# Altium schematic sheet 10-Sensing.SchDoc: Sensing (part 2 of 2)
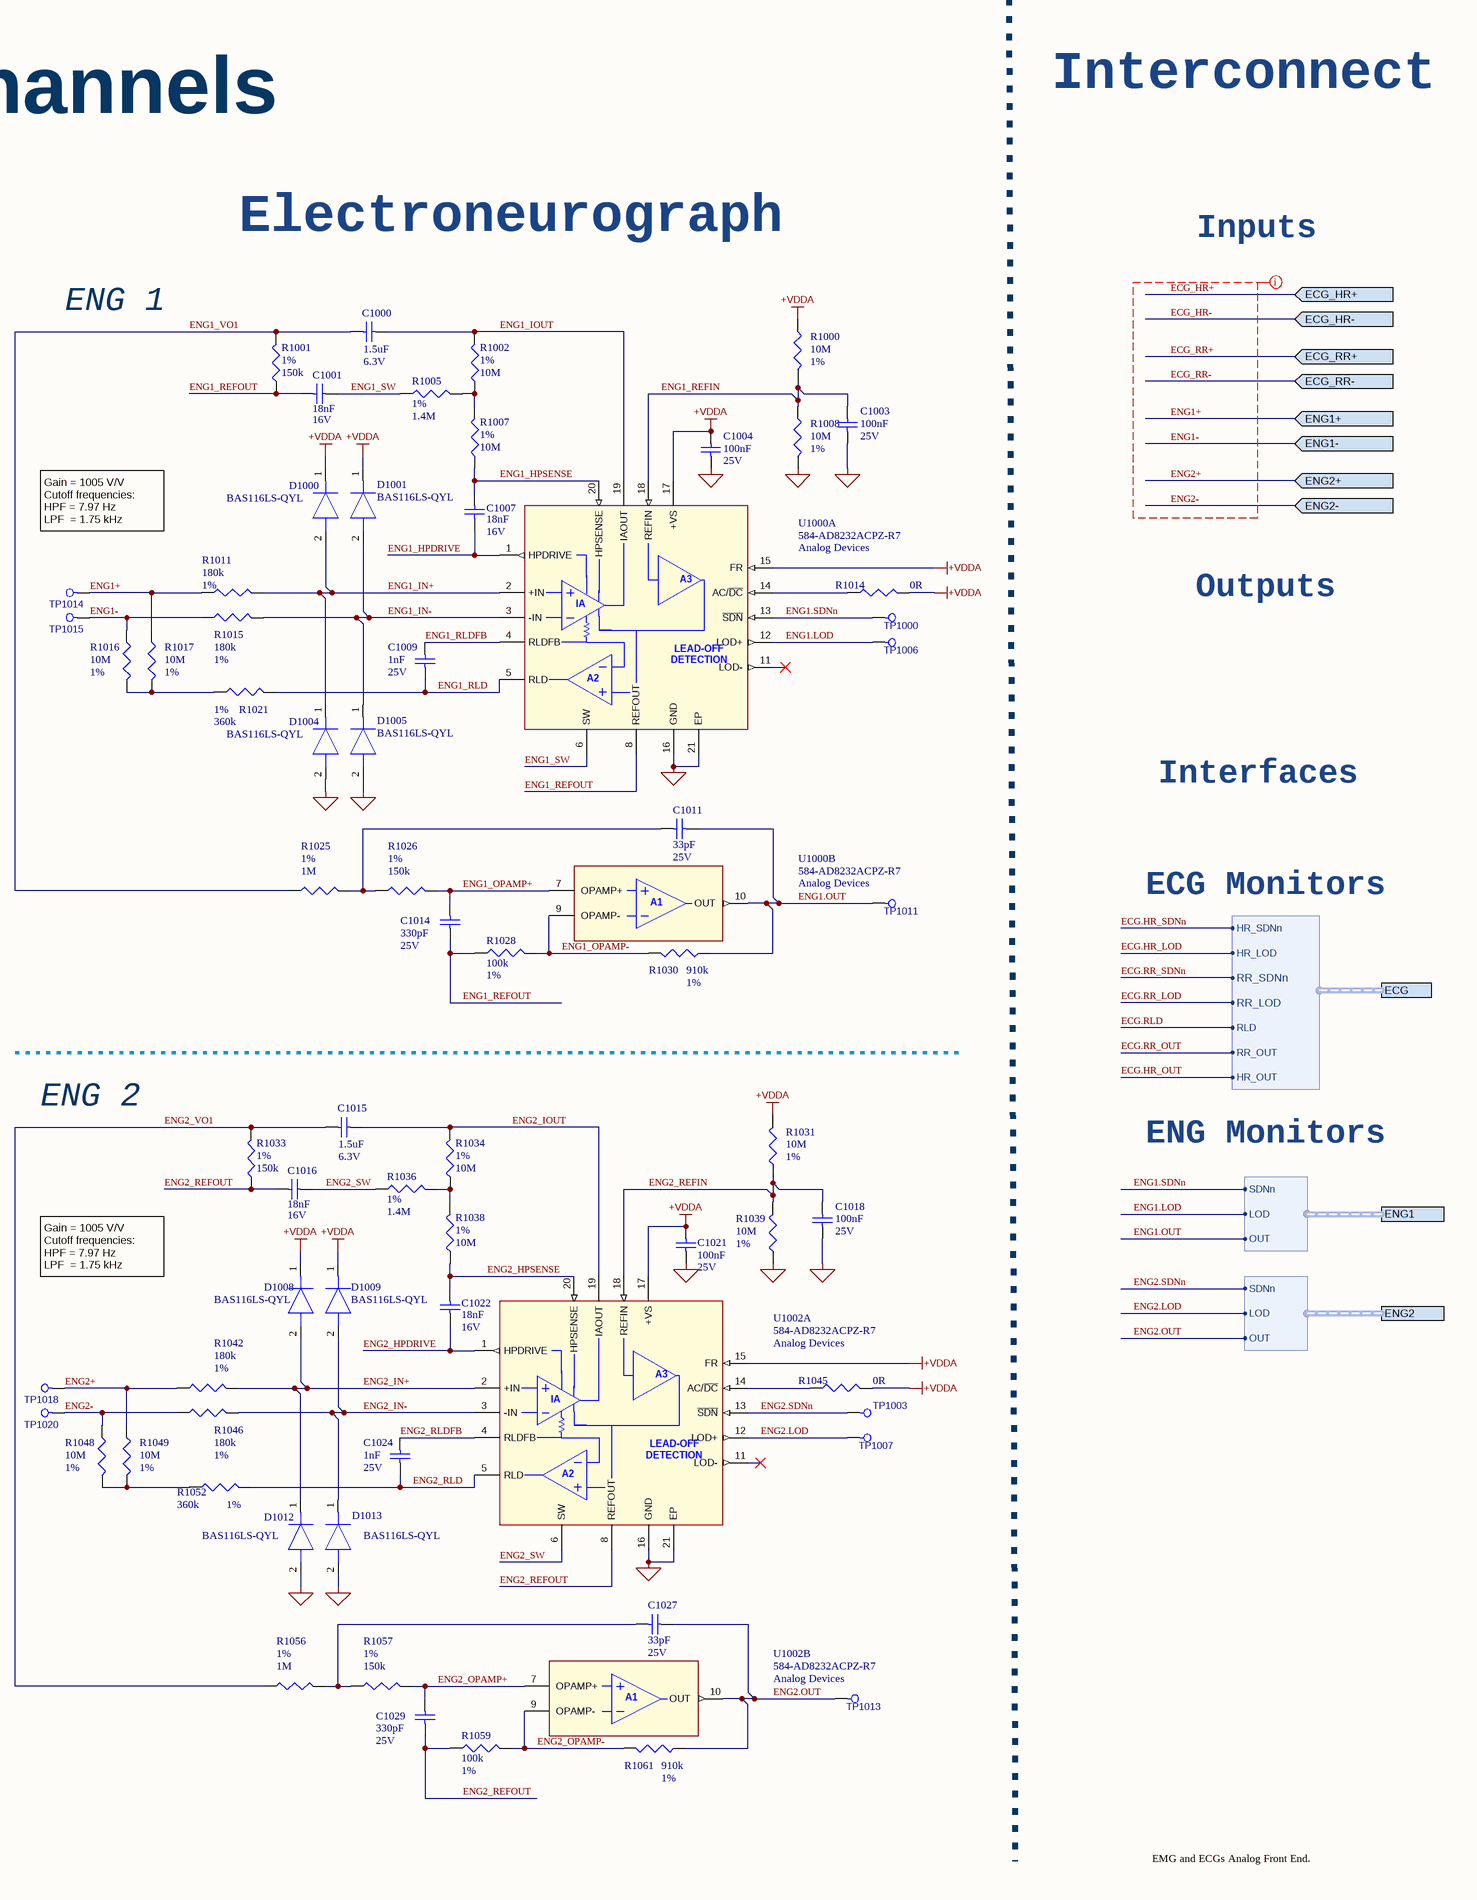
[diagram p2: 10-Sensing.SchDoc, right]

## Library data of the parts
C1000 C1015 = GRM033R60J155ME14D: Ceramic Capacitor, Multilayer, Ceramic, 6.3V, 20% +Tol, 20% -Tol, X5R, 15% TC, 1.5uF, Surface Mount, 0201; Manufacturer: Murata; Multilayer: Yes; Supplier: Digikey; Supplier Part Number: 490-13223-1-ND; Manufacturer Part Number: GRM033R60J155ME14D; RoHS: Yes; Category: Ceramic Capacitors; Stock: 47845; Pricing: 1=0,2, 10=0,131, 50=0,083, 100=0,0664, 500=0,04794, 1000=0,04241, 2500=0,04056, 5000=0,03687 (USD); Mounting Technology: Surface Mount; Pins: 2; Dielectric Material: Ceramic; Package Shape: Rectangular; Case/Package: 0201; Min Operating Temperature: -55°C; Max Operating Temperature: 85°C; Capacitor Type: Ceramic; Tolerance  (fill in as +-): 20%; Packaging: Tape and Reel; Tolerance (fill in as +-): 20%; Temperature Characteristics Code: X5R; Termination: Wraparound; Reach SVHC Compliant: Yes; RoHS Compliant: Yes; ComponentLink1URL: https://psearch.en.murata.com:443/capacitor/product/GRM033R60J155ME14%23.pdf?src-supplier=IHS+Markit; ComponentLink1Description: https://psearch.en.murata.com:443/capacitor/product/GRM033R60J155ME14%23.pdf?src-supplier=IHS+Markit; ComponentLink2URL: http://search.murata.co.jp/Ceramy/image/img/A01X/G101/ENG/GRM033R60J155ME14-01.pdf?src-supplier=Digikey; ComponentLink2Description: http://search.murata.co.jp/Ceramy/image/img/A01X/G101/ENG/GRM033R60J155ME14-01.pdf?src-supplier=Digikey; ComponentLink3URL: http://search.murata.co.jp/Ceramy/image/img/A01X/partnumbering_e_01.pdf?src-supplier=Digikey; ComponentLink3Description: http://search.murata.co.jp/Ceramy/image/img/A01X/partnumbering_e_01.pdf?src-supplier=Digikey; Supplier 1: Arrow Electronics; Supplier Part Number 1: GRM033R60J155ME14D
C1001 C1007 C1016 C1022 = GRM033R61C183KE84D: Ceramic Capacitor, Multilayer, Ceramic, 16V, 20% +Tol, 20% -Tol, X5R, 15% TC, 0.018uF, Surface Mount, 0201; Manufacturer: Murata; Multilayer: Yes; Manufacturer Part Number: GRM033R61C183KE84D; Category: Ceramic Capacitors; Supplier 1: Digikey; Supplier Part Number 1: 490-10414-1-ND; RoHS: Yes; Stock: 109140; Pricing: 1=0,1, 10=0,044, 50=0,0254, 100=0,0196, 500=0,01478, 1000=0,01161, 2500=0,01056, 5000=0,00971 (USD); Mounting Technology: Surface Mount; Pins: 2; Dielectric Material: Ceramic; Package Shape: Rectangular; Case/Package: 0201; Terminal Finish: Nickel; Min Operating Temperature: -55°C; Max Operating Temperature: 85°C; JESD-609 Code: e3; Capacitor Type: Ceramic; Tolerance  (fill in as +-): 20%; Package Style: SMTMeter; Packaging: Tape and Reel; Tolerance (fill in as +-): 20%; Temperature Characteristics Code: X5R; Termination: Wraparound; Length: 0.6mm; Width: 0.3mm; Height: 0.3mm; Reach SVHC Compliant: Yes; RoHS Compliant: Yes; ComponentLink1URL: https://psearch.en.murata.com:443/capacitor/product/GRM033R61C223ME84%23.pdf?src-supplier=IHS+Markit; ComponentLink1Description: https://psearch.en.murata.com:443/capacitor/product/GRM033R61C223ME84%23.pdf?src-supplier=IHS+Markit; ComponentLink2URL: http://www.farnell.com/datasheets/2735417.pdf?src-supplier=Farnell; ComponentLink2Description: http://www.farnell.com/datasheets/2735417.pdf?src-supplier=Farnell; ComponentLink3URL: http://search.murata.co.jp/Ceramy/image/img/A01X/G101/ENG/GRM033R61C223ME84-01.pdf?src-supplier=Digikey; ComponentLink3Description: http://search.murata.co.jp/Ceramy/image/img/A01X/G101/ENG/GRM033R61C223ME84-01.pdf?src-supplier=Digikey
C1002 C1008 = CGA2B1X7S1C334K050BC: Capacitor, 0.33uF, X7S, 16V, 10%, 0402; Manufacturer: TDK; Medical Grade MFR: TBD; Review: 020823; Length (mm): 1.00 ±0.05; Medical Grade MFR PN: TBD; PCB Footprint: cap0402_reduced; Thickness (mm): 0.50 ±0.05; Width (mm): 0.50 ±0.05; Category: Capacitor; Package Description: 0402; Supplier 1: Arrow Electronics; Supplier Part Number 1: CGA2B1X7S1C334K050BC; Status: Approved; Manufacturer Part Number: CGA2B1X7S1C334K050BC
C1003-C1006 C1018-C1021 C1026 C1028 = GRM033R61E104KE14J: Ceramic Capacitor, Multilayer, Ceramic, 25V, 10% +Tol, 10% -Tol, X5R, 15% TC, 0.1uF, Surface Mount, 0201; Manufacturer: Murata; Multilayer: Yes; Category: Ceramic Capacitors; Supplier: Digikey; Supplier Part Number: 490-14571-1-ND; Manufacturer Part Number: GRM033R61E104KE14J; RoHS: Yes; Stock: 1540851; Pricing: 1=0,1, 10=0,033, 50=0,0192, 100=0,0148, 500=0,01118, 1000=0,00878, 2500=0,00798, 5000=0,00734 (USD); Mounting Technology: Surface Mount; Pins: 2; Dielectric Material: Ceramic; Package Shape: Rectangular; Case/Package: 0201; Terminal Finish: Nickel; Min Operating Temperature: -55°C; Max Operating Temperature: 85°C; JESD-609 Code: e3; Capacitor Type: Ceramic; Tolerance  (fill in as +-): 10%; Package Style: SMTMeter; Packaging: Tape and Reel; Tolerance (fill in as +-): 10%; Temperature Characteristics Code: X5R; Termination: Wraparound; Length: 0.6mm; Width: 0.3mm; Height: 0.3mm; Reach SVHC Compliant: Yes; RoHS Compliant: Yes; ComponentLink1URL: https://psearch.en.murata.com:443/capacitor/product/GRM033R61E104KE14%23.pdf?src-supplier=IHS+Markit; ComponentLink1Description: https://psearch.en.murata.com:443/capacitor/product/GRM033R61E104KE14%23.pdf?src-supplier=IHS+Markit; ComponentLink2URL: http://www.mouser.com/ds/2/281/c02e-2905.pdf?src-supplier=Mouser; ComponentLink2Description: http://www.mouser.com/ds/2/281/c02e-2905.pdf?src-supplier=Mouser; ComponentLink3URL: http://search.murata.co.jp/Ceramy/image/img/A01X/G101/ENG/GRM033R61E104KE14-01.pdf?src-supplier=Digikey; ComponentLink3Description: http://search.murata.co.jp/Ceramy/image/img/A01X/G101/ENG/GRM033R61E104KE14-01.pdf?src-supplier=Digikey; ComponentLink4URL: https://search.murata.co.jp/Ceramy/image/img/A01X/G101/ENG/GRM033R61E104KE14-01.pdf?src-supplier=Digikey; ComponentLink4Description: https://search.murata.co.jp/Ceramy/image/img/A01X/G101/ENG/GRM033R61E104KE14-01.pdf?src-supplier=Digikey; Supplier 1: Arrow Electronics; Supplier Part Number 1: GRM033R61E104KE14J
C1009 C1010 C1013 C1024 C1025 = GRM033R71E102KA01J: Ceramic Capacitor, Multilayer, Ceramic, 25V, 10% +Tol, 10% -Tol, X7R, 15% TC, 0.001uF, Surface Mount, 0201; Manufacturer: Murata; Multilayer: Yes; Supplier: Digikey; Supplier Part Number: 490-8161-1-ND; Manufacturer Part Number: GRM033R71E102KA01J; RoHS: Yes; Category: Ceramic Capacitors; Stock: 136185; Pricing: 1=0,1, 10=0,01, 50=0,0056, 100=0,0044, 500=0,00328, 1000=0,00258, 2500=0,00234, 5000=0,00216 (USD); Mounting Technology: Surface Mount; Pins: 2; Dielectric Material: Ceramic; Package Shape: Rectangular; Case/Package: 0201; Terminal Finish: Nickel; Min Operating Temperature: -55°C; Max Operating Temperature: 125°C; JESD-609 Code: e3; Capacitor Type: Ceramic; Tolerance  (fill in as +-): 10%; Package Style: SMTMeter; Packaging: Tape and Reel; Tolerance (fill in as +-): 10%; Temperature Characteristics Code: X7R; Termination: Wraparound; Length: 0.6mm; Width: 0.3mm; Height: 0.3mm; Reach SVHC Compliant: Yes; RoHS Compliant: Yes; ComponentLink1URL: https://psearch.en.murata.com:443/capacitor/product/GRM033R71E102KA01%23.pdf?src-supplier=IHS+Markit; ComponentLink1Description: https://psearch.en.murata.com:443/capacitor/product/GRM033R71E102KA01%23.pdf?src-supplier=IHS+Markit; ComponentLink2URL: https://datasheet.ciiva.com/5453/product-5453157.pdf?src-supplier=Mouser; ComponentLink2Description: https://datasheet.ciiva.com/5453/product-5453157.pdf?src-supplier=Mouser; ComponentLink3URL: https://datasheet.ciiva.com/11621/product-11621675.pdf?src-supplier=Avnet; ComponentLink3Description: https://datasheet.ciiva.com/11621/product-11621675.pdf?src-supplier=Avnet; Supplier 1: Arrow Electronics; Supplier Part Number 1: GRM033R71E102KA01J
C1011 C1027 = GRM0335C1E330JA01D: Ceramic Capacitor, Multilayer, Ceramic, 25V, 5% +Tol, 5% -Tol, C0G, 30ppm/Cel TC, 0.000033uF, Surface Mount, 0201; Manufacturer: Murata; Multilayer: Yes; Supplier: Digikey; Supplier Part Number: 490-10678-1-ND; Manufacturer Part Number: GRM0335C1E330JA01D; RoHS: Yes; Category: Ceramic Capacitors; Stock: 355128; Pricing: 1=0,1, 10=0,011, 50=0,0062, 100=0,0048, 500=0,0036, 1000=0,00283, 2500=0,00258, 5000=0,00237 (USD); Mounting Technology: Surface Mount; Pins: 2; Dielectric Material: Ceramic; Package Shape: Rectangular; Case/Package: 0201; Terminal Finish: Nickel; Min Operating Temperature: -55°C; Max Operating Temperature: 125°C; JESD-609 Code: e3; Capacitor Type: Ceramic; Package Style: SMTMeter; Packaging: Tape and Reel; Temperature Characteristics Code: C0G; Termination: Wraparound; Length: 0.6mm; Width: 0.3mm; Height: 0.3mm; Reach SVHC Compliant: Yes; RoHS Compliant: Yes; Supplier 1: Arrow Electronics; Supplier Part Number 1: GRM0335C1E330JA01D; Tolerance  (fill in as +-): 5%; Tolerance (fill in as +-): 5%; ComponentLink1URL: https://datasheet.ciiva.com:443/pdfs/VipMasterIC/IC/MURE/MURE-S-A0004347008/MURE-S-A0004347461-1.pdf?src-supplier=IHS+Markit; ComponentLink1Description: https://datasheet.ciiva.com:443/pdfs/VipMasterIC/IC/MURE/MURE-S-A0004347008/MURE-S-A0004347461-1.pdf?src-supplier=IHS+Markit; ComponentLink2URL: https://datasheet.ciiva.com/29538/partnumbering-e-01-29538933.pdf?src-supplier=Digikey; ComponentLink2Description: https://datasheet.ciiva.com/29538/partnumbering-e-01-29538933.pdf?src-supplier=Digikey
C1012 = GCM155R71H152KA37D: Capacitor, 1500pF, X7R, 50V, 10%, 0402; Manufacturer: Murata; Medical Grade MFR: TBD; Review: 020823; Length (mm): 1.00 ±0.05; Medical Grade MFR PN: TBD; PCB Footprint: cap0402_reduced; Thickness (mm): 0.50 ±0.05; Width (mm): 0.50 ±0.05; Category: Capacitor; Package Description: 0402; Supplier 1: Arrow Electronics; Supplier Part Number 1: GCM155R71H152KA37D; Status: Approved; Manufacturer Part Number: GCM155R71H152KA37D
C1014 C1029 = GRM033R71E331KA01D: Ceramic Capacitor, Multilayer, Ceramic, 25V, 10% +Tol, 10% -Tol, X7R, 15% TC, 0.00033uF, Surface Mount, 0201; Manufacturer: Murata; Multilayer: Yes; Supplier: Digikey; Supplier Part Number: 490-3178-1-ND; Manufacturer Part Number: GRM033R71E331KA01D; RoHS: Yes; Category: Ceramic Capacitors; Stock: 408699; Pricing: 1=0,1, 10=0,02, 50=0,0118, 100=0,0091, 500=0,00684, 1000=0,00538, 2500=0,00489, 5000=0,0045 (USD); Mounting Technology: Surface Mount; Pins: 2; Dielectric Material: Ceramic; Package Shape: Rectangular; Case/Package: 0201; Terminal Finish: Nickel; Min Operating Temperature: -55°C; Max Operating Temperature: 125°C; JESD-609 Code: e3; Capacitor Type: Ceramic; Tolerance  (fill in as +-): 10%; Package Style: SMTMeter; Packaging: Tape and Reel; Tolerance (fill in as +-): 10%; Temperature Characteristics Code: X7R; Termination: Wraparound; Length: 0.6mm; Width: 0.3mm; Height: 0.3mm; Reach SVHC Compliant: Yes; RoHS Compliant: Yes; Supplier 1: Arrow Electronics; Supplier Part Number 1: GRM033R71E331KA01D; ComponentLink1URL: https://psearch.en.murata.com:443/capacitor/product/GRM033R71E331KA01%23.pdf?src-supplier=IHS+Markit; ComponentLink1Description: https://psearch.en.murata.com:443/capacitor/product/GRM033R71E331KA01%23.pdf?src-supplier=IHS+Markit; ComponentLink2URL: https://datasheet.ciiva.com/16396/product-16396160.pdf?src-supplier=Future+Electronics; ComponentLink2Description: https://datasheet.ciiva.com/16396/product-16396160.pdf?src-supplier=Future+Electronics; ComponentLink3URL: https://datasheet.ciiva.com/18184/getdatasheetpartid-228493-18184123.pdf?src-supplier=Verical; ComponentLink3Description: https://datasheet.ciiva.com/18184/getdatasheetpartid-228493-18184123.pdf?src-supplier=Verical; ComponentLink4URL: https://datasheet.ciiva.com/29199/455855-da-01-en-vs-kondensator-0201-29199192.pdf?src-supplier=Conrad; ComponentLink4Description: https://datasheet.ciiva.com/29199/455855-da-01-en-vs-kondensator-0201-29199192.pdf?src-supplier=Conrad; ComponentLink5URL: https://datasheet.ciiva.com/6068/482872-6068150.pdf?src-supplier=Farnell; ComponentLink5Description: https://datasheet.ciiva.com/6068/482872-6068150.pdf?src-supplier=Farnell; ComponentLink6URL: https://datasheet.ciiva.com/7937/482872-7937607.pdf?src-supplier=Element14; ComponentLink6Description: https://datasheet.ciiva.com/7937/482872-7937607.pdf?src-supplier=Element14; ComponentLink7URL: https://datasheet.ciiva.com/7937/482872-7937608.pdf?src-supplier=Element14; ComponentLink7Description: https://datasheet.ciiva.com/7937/482872-7937608.pdf?src-supplier=Element14; ComponentLink8URL: https://datasheet.ciiva.com/161/grm033r71e331ka01-01-161478.pdf?src-supplier=Digikey; ComponentLink8Description: https://datasheet.ciiva.com/161/grm033r71e331ka01-01-161478.pdf?src-supplier=Digikey; ComponentLink9URL: https://datasheet.ciiva.com/161/grm033r71e331ka01-01-161479.pdf?src-supplier=Digikey; ComponentLink9Description: https://datasheet.ciiva.com/161/grm033r71e331ka01-01-161479.pdf?src-supplier=Digikey; ComponentLink10URL: https://datasheet.ciiva.com/11604/product-11604876.pdf?src-supplier=Avnet; ComponentLink10Description: https://datasheet.ciiva.com/11604/product-11604876.pdf?src-supplier=Avnet
C1017 C1023 = GRM188Z71C225ME43J: Capacitor, 2.2uF, X7R, 16V, 10%, 0603, Implant-grade; Manufacturer: Murata; Medical Grade MFR: TBD; Review: 020823; Length (mm): 1.60 ±0.10; Medical Grade MFR PN: TBD; PCB Footprint: cap0603_reduced; Thickness (mm): 0.80 ±0.10; Width (mm): 0.80 ±0.10; Category: Capacitor; Package Description: 0603; Supplier 1: Digi-Key; Supplier Part Number 1: 490-GRM188Z71C225ME43JCT-ND; Status: Approved; Manufacturer Part Number: GRM188Z71C225ME43J
D1000-D1015 = BAS116LS-QYL: Diode; Manufacturer: Nexperia; Datasheet Link: https://assets.nexperia.com/documents/data-sheet/BAS116LS-Q.pdf; Height: 0.5mm; Mouser Part Number: 771-BAS116LS-QYL; Mouser Price/Stock: https://www.mouser.co.uk/ProductDetail/Nexperia/BAS116LS-QYL?qs=Li%252BoUPsLEnuSHegtSMB1TQ%3D%3D; Arrow Part Number: BAS116LS-QYL; Arrow Price/Stock: https://www.arrow.com/en/products/bas116ls-qyl/nexperia?region=nac; Supplier 1: Digikey; Supplier Part Number 1: 1727-BAS116LS-QYLCT-ND; Manufacturer Part Number: BAS116LS-QYL
R1000 R1002-R1004 R1007-R1010 R1016 R1017 R1019 R1020 R1031 R1032 R1034 R1038 R1039 R1041 R1048-R1051 = CRCW020110M0FNED: Fixed Resistor, Metal Glaze/thick Film, 0.05W, 10000000ohm, 30V, 1% +/-Tol, 200ppm/Cel, Surface Mount, 0201; Manufacturer: Vishay Draloric; Medical Grade MFR: Mini-Systems; Medical Grade MFR PN: MWA96SM-1005F-NS62TR; Power: 50mW; Rated Temperature: 70°C; Temperature Coefficient: 200ppm/°C; Category: Chip SMD Resistors; Supplier: Mouser; Supplier Part Number: 71-CRCW020110M0FNED; Manufacturer Part Number: CRCW020110M0FNED; RoHS: Yes; Stock: 159754; Pricing: 1=0,1, 10=0,024, 50=0,024, 100=0,014, 1000=0,011, 10000=0,006 (USD); Mounting Technology: Surface Mount; Pins: 2; Package Shape: Rectangular; Case/Package: 0201; Terminal Finish: Nickel; Min Operating Temperature: -55°C; Max Operating Temperature: 155°C; JESD-609 Code: e3; Resistor Type: FIXED RESISTOR; Packaging: Tape and Reel; Technology: METAL GLAZE/THICK FILM; Termination: Wraparound; Working Voltage: 30V; Reach SVHC Compliant: Yes; RoHS Compliant: Yes; ComponentLink1URL: https://datasheet.ciiva.com:443/pdfs/VipMasterIC/IC/VISH/VISH-S-A0002932828/VISH-S-A0002932828-1.pdf?src-supplier=IHS+Markit; ComponentLink1Description: https://datasheet.ciiva.com:443/pdfs/VipMasterIC/IC/VISH/VISH-S-A0002932828/VISH-S-A0002932828-1.pdf?src-supplier=IHS+Markit; ComponentLink2URL: https://datasheet.ciiva.com/7673/1719906-7673177.pdf?src-supplier=Element14; ComponentLink2Description: https://datasheet.ciiva.com/7673/1719906-7673177.pdf?src-supplier=Element14; ComponentLink3URL: https://datasheet.ciiva.com/7673/1719906-7673178.pdf?src-supplier=Element14; ComponentLink3Description: https://datasheet.ciiva.com/7673/1719906-7673178.pdf?src-supplier=Element14; ComponentLink4URL: https://datasheet.ciiva.com/22692/1719906-22692711.pdf?src-supplier=Element14; ComponentLink4Description: https://datasheet.ciiva.com/22692/1719906-22692711.pdf?src-supplier=Element14; ComponentLink5URL: https://datasheet.ciiva.com/22665/1700795-22665701.pdf?src-supplier=Element14; ComponentLink5Description: https://datasheet.ciiva.com/22665/1700795-22665701.pdf?src-supplier=Element14; Supplier 1: Digikey; Supplier Part Number 1: 541-CRCW020110M0FNEDCT-ND
R1001 R1026 R1033 R1057 = CRCW0201150KFNED: Fixed Resistor, Metal Glaze/thick Film, 0.05W, 150000ohm, 30V, 1% +/-Tol, 200ppm/Cel, Surface Mount, 0201; Manufacturer: Vishay; Medical Grade MFR: Mini-Systems; Medical Grade MFR PN: MWA96SM-1503F-NS62TR; Power: 50mW; Rated Temperature: 70°C; Temperature Coefficient: 200ppm/°C; Package Height: 0.23mm; Package Length: 0.6mm; Package Width: 0.3mm; Reference Standard: AEC-Q200; Supplier: Digikey; Supplier Part Number: 541-CRCW0201150KFNEDCT-ND; Manufacturer Part Number: CRCW0201150KFNED; RoHS: Yes; Category: Chip SMD Resistors; Stock: 35009; Pricing: 1=0,1, 10=0,037, 50=0,0242, 100=0,0204, 500=0,01426, 1000=0,01241, 5000=0,00924 (USD); Mounting Technology: Surface Mount; Pins: 2; Package Shape: Rectangular; Case/Package: 0201; Terminal Finish: Nickel; Min Operating Temperature: -55°C; Max Operating Temperature: 155°C; JESD-609 Code: e3; Resistor Type: FIXED RESISTOR; Construction: Chip; Package Style: SMTMeter; Packaging: Tape and Reel; Technology: METAL GLAZE/THICK FILM; Termination: Wraparound; Working Voltage: 30V; Reach SVHC Compliant: Yes; RoHS Compliant: Yes; ComponentLink1URL: https://datasheet.ciiva.com:443/pdfs/VipMasterIC/IC/VISH/VISH-S-A0002932828/VISH-S-A0002932828-1.pdf?src-supplier=IHS+Markit; ComponentLink1Description: https://datasheet.ciiva.com:443/pdfs/VipMasterIC/IC/VISH/VISH-S-A0002932828/VISH-S-A0002932828-1.pdf?src-supplier=IHS+Markit; ComponentLink2URL: https://datasheet.ciiva.com/7673/1719906-7673181.pdf?src-supplier=Element14; ComponentLink2Description: https://datasheet.ciiva.com/7673/1719906-7673181.pdf?src-supplier=Element14; ComponentLink3URL: https://datasheet.ciiva.com/7673/1719906-7673182.pdf?src-supplier=Element14; ComponentLink3Description: https://datasheet.ciiva.com/7673/1719906-7673182.pdf?src-supplier=Element14; ComponentLink4URL: https://datasheet.ciiva.com/2577/crcw0201e3-2577323.pdf?src-supplier=Digikey; ComponentLink4Description: https://datasheet.ciiva.com/2577/crcw0201e3-2577323.pdf?src-supplier=Digikey; ComponentLink5URL: https://datasheet.ciiva.com/8968/crcw0201e3-8968685.pdf?src-supplier=Avnet; ComponentLink5Description: https://datasheet.ciiva.com/8968/crcw0201e3-8968685.pdf?src-supplier=Avnet; ComponentLink6URL: https://datasheet.ciiva.com/22692/1719906-22692733.pdf?src-supplier=Element14; ComponentLink6Description: https://datasheet.ciiva.com/22692/1719906-22692733.pdf?src-supplier=Element14; Supplier 1: Digikey; Supplier Part Number 1: 541-CRCW0201150KFNEDDKR-ND
R1005 R1006 R1036 = CRCW02011M40FNED: Fixed Resistor, Metal Glaze/thick Film, 0.05W, 1400000ohm, 30V, 1% +/-Tol, 200ppm/Cel, Surface Mount, 0201; Manufacturer: Vishay Draloric; Medical Grade MFR: Mini-Systems; Medical Grade MFR PN: MWA96SM-1404F-NS62TR; Power: 50mW; Rated Temperature: 70°C; Temperature Coefficient: 200ppm/°C; Supplier: Digikey; Supplier Part Number: 541-CRCW02011M40FNEDCT-ND; Manufacturer Part Number: CRCW02011M40FNED; RoHS: Yes; Category: Chip SMD Resistors; Stock: 24065; Pricing: 1=0,1, 10=0,037, 50=0,0242, 100=0,0204, 500=0,01426, 1000=0,01241, 5000=0,00924 (USD); Mounting Technology: Surface Mount; Pins: 2; Package Shape: Rectangular; Case/Package: 0201; Terminal Finish: Nickel; Min Operating Temperature: -55°C; Max Operating Temperature: 155°C; JESD-609 Code: e3; Resistor Type: FIXED RESISTOR; Packaging: Tape and Reel; Termination: Wraparound; Working Voltage: 30V; Reach SVHC Compliant: Yes; RoHS Compliant: Yes; Supplier 1: Digikey; Supplier Part Number 1: 541-CRCW02011M40FNEDCT-ND; Technology: METAL GLAZE/THICK FILM; ComponentLink1URL: https://datasheet.ciiva.com:443/pdfs/VipMasterIC/IC/VISH/VISH-S-A0002932828/VISH-S-A0002932828-1.pdf?src-supplier=IHS+Markit; ComponentLink1Description: https://datasheet.ciiva.com:443/pdfs/VipMasterIC/IC/VISH/VISH-S-A0002932828/VISH-S-A0002932828-1.pdf?src-supplier=IHS+Markit; ComponentLink2URL: http://www.farnell.com/datasheets/2111203.pdf?src-supplier=Farnell; ComponentLink2Description: http://www.farnell.com/datasheets/2111203.pdf?src-supplier=Farnell; ComponentLink3URL: http://www.farnell.com/datasheets/2238160.pdf?src-supplier=Farnell; ComponentLink3Description: http://www.farnell.com/datasheets/2238160.pdf?src-supplier=Farnell; ComponentLink4URL: http://www.farnell.com/datasheets/2111203.pdf?src-supplier=Element14; ComponentLink4Description: http://www.farnell.com/datasheets/2111203.pdf?src-supplier=Element14; ComponentLink5URL: http://www.farnell.com/datasheets/2045973.pdf?src-supplier=Element14; ComponentLink5Description: http://www.farnell.com/datasheets/2045973.pdf?src-supplier=Element14; ComponentLink6URL: http://www.farnell.com/datasheets/1719906.pdf?src-supplier=Element14; ComponentLink6Description: http://www.farnell.com/datasheets/1719906.pdf?src-supplier=Element14; ComponentLink7URL: http://www.vishay.com/docs/20052/crcw0201e3.pdf?src-supplier=Digikey; ComponentLink7Description: http://www.vishay.com/docs/20052/crcw0201e3.pdf?src-supplier=Digikey
R1011 R1012 R1015 R1018 R1042 R1043 R1046 R1047 = CRCW0201180KFNED: Fixed Resistor, Metal Glaze/thick Film, 0.05W, 180000ohm, 30V, 1% +/-Tol, 200ppm/Cel, Surface Mount, 0201; Manufacturer: Vishay; Medical Grade MFR: Mini-Systems; Medical Grade MFR PN: MWA96SM-1803F-NS62TR; Power: 50mW; Rated Temperature: 70°C; Temperature Coefficient: 200ppm/°C; Package Height: 0.23mm; Package Length: 0.6mm; Package Width: 0.3mm; Reference Standard: AEC-Q200; Category: Chip SMD Resistors; Supplier: Digikey; Supplier Part Number: 541-CRCW0201180KFNEDCT-ND; Manufacturer Part Number: CRCW0201180KFNED; RoHS: Yes; Stock: 52185; Pricing: 1=0,1, 10=0,037, 50=0,0242, 100=0,0204, 500=0,01426, 1000=0,01241, 5000=0,00924 (USD); Mounting Technology: Surface Mount; Pins: 2; Package Shape: Rectangular; Case/Package: 0201; Terminal Finish: Nickel; Min Operating Temperature: -55°C; Max Operating Temperature: 155°C; JESD-609 Code: e3; Resistor Type: FIXED RESISTOR; Construction: Chip; Package Style: SMTMeter; Packaging: Tape and Reel; Technology: METAL GLAZE/THICK FILM; Termination: Wraparound; Working Voltage: 30V; Reach SVHC Compliant: Yes; RoHS Compliant: Yes; ComponentLink1URL: https://datasheet.ciiva.com:443/pdfs/VipMasterIC/IC/VISH/VISH-S-A0002932828/VISH-S-A0002932828-1.pdf?src-supplier=IHS+Markit; ComponentLink1Description: https://datasheet.ciiva.com:443/pdfs/VipMasterIC/IC/VISH/VISH-S-A0002932828/VISH-S-A0002932828-1.pdf?src-supplier=IHS+Markit; ComponentLink2URL: https://datasheet.ciiva.com/7714/1719906-7714127.pdf?src-supplier=Element14; ComponentLink2Description: https://datasheet.ciiva.com/7714/1719906-7714127.pdf?src-supplier=Element14; ComponentLink3URL: https://datasheet.ciiva.com/22665/1700795-22665798.pdf?src-supplier=Element14; ComponentLink3Description: https://datasheet.ciiva.com/22665/1700795-22665798.pdf?src-supplier=Element14; ComponentLink4URL: https://datasheet.ciiva.com/22692/1719906-22692745.pdf?src-supplier=Element14; ComponentLink4Description: https://datasheet.ciiva.com/22692/1719906-22692745.pdf?src-supplier=Element14; Supplier 1: Digikey; Supplier Part Number 1: 541-CRCW0201180KFNEDCT-ND
R1013 R1014 R1044 R1045 = CRCW02010000Z0ED: Fixed Resistor, Metal Glaze/thick Film, 0.05W, 0ohm, Surface Mount, 0201; Manufacturer: Vishay; Medical Grade MFR: Mini-Systems; Medical Grade MFR PN: MWA96SM-0000F-NS62TR; Power: 50mW; Rated Temperature: 70°C; Package Height: 0.23mm; Package Length: 0.6mm; Package Width: 0.3mm; Reference Standard: AEC-Q200; Category: Chip SMD Resistors; Supplier: Digikey; Supplier Part Number: 541-0.0AGCT-ND; Manufacturer Part Number: CRCW02010000Z0ED; RoHS: Yes; Stock: 701366; Pricing: 1=0,1, 10=0,034, 25=0,026, 50=0,0198, 100=0,0138, 250=0,01112, 500=0,0089, 1000=0,00655, 5000=0,0047 (USD); Mounting Technology: Surface Mount; Pins: 2; Package Shape: Rectangular; Case/Package: 0201; Terminal Finish: Nickel; Min Operating Temperature: -55°C; Max Operating Temperature: 155°C; JESD-609 Code: e3; Resistor Type: FIXED RESISTOR; Construction: Chip; Package Style: SMTMeter; Packaging: Tape and Reel; Technology: METAL GLAZE/THICK FILM; Termination: Wraparound; Reach SVHC Compliant: Yes; RoHS Compliant: Yes; ComponentLink1URL: https://datasheet.ciiva.com:443/pdfs/VipMasterIC/IC/VISH/VISH-S-A0002932828/VISH-S-A0002932828-1.pdf?src-supplier=IHS+Markit; ComponentLink1Description: https://datasheet.ciiva.com:443/pdfs/VipMasterIC/IC/VISH/VISH-S-A0002932828/VISH-S-A0002932828-1.pdf?src-supplier=IHS+Markit; ComponentLink2URL: https://datasheet.ciiva.com/2471/crcw0201e3-2471712.pdf?src-supplier=Digikey; ComponentLink2Description: https://datasheet.ciiva.com/2471/crcw0201e3-2471712.pdf?src-supplier=Digikey; ComponentLink3URL: https://datasheet.ciiva.com/7841/1719906-7841431.pdf?src-supplier=Element14; ComponentLink3Description: https://datasheet.ciiva.com/7841/1719906-7841431.pdf?src-supplier=Element14; ComponentLink4URL: https://datasheet.ciiva.com/7841/1719906-7841430.pdf?src-supplier=Element14; ComponentLink4Description: https://datasheet.ciiva.com/7841/1719906-7841430.pdf?src-supplier=Element14; ComponentLink5URL: https://datasheet.ciiva.com/22665/1847332-22665688.pdf?src-supplier=Element14; ComponentLink5Description: https://datasheet.ciiva.com/22665/1847332-22665688.pdf?src-supplier=Element14; ComponentLink6URL: https://datasheet.ciiva.com/2471/crcw0201e3-2471713.pdf?src-supplier=Digikey; ComponentLink6Description: https://datasheet.ciiva.com/2471/crcw0201e3-2471713.pdf?src-supplier=Digikey; ComponentLink7URL: https://datasheet.ciiva.com/2471/crcw0201e3-2471711.pdf?src-supplier=Digikey; ComponentLink7Description: https://datasheet.ciiva.com/2471/crcw0201e3-2471711.pdf?src-supplier=Digikey; ComponentLink8URL: https://datasheet.ciiva.com/16757/70202042-16757849.pdf?src-supplier=Allied+Electronics; ComponentLink8Description: https://datasheet.ciiva.com/16757/70202042-16757849.pdf?src-supplier=Allied+Electronics; ComponentLink9URL: https://datasheet.ciiva.com/16436/crcw0201e3-16436237.pdf?src-supplier=Future+Electronics; ComponentLink9Description: https://datasheet.ciiva.com/16436/crcw0201e3-16436237.pdf?src-supplier=Future+Electronics; Supplier 1: Digikey; Supplier Part Number 1: 541-0.0AGDKR-ND
R1021 R1022 R1052 R1053 = CRCW0201360KFNED: Fixed Resistor, Metal Glaze/thick Film, 0.05W, 360000ohm, 30V, 1% +/-Tol, 200ppm/Cel, Surface Mount, 0201; Manufacturer: Vishay; Medical Grade MFR: TBD; Power: 50mW; Rated Temperature: 70°C; Temperature Coefficient: 200ppm/°C; Package Height: 0.23mm; Package Length: 0.6mm; Package Width: 0.3mm; Reference Standard: AEC-Q200; Category: Chip SMD Resistors; Supplier: Digikey; Supplier Part Number: 541-CRCW0201360KFNEDCT-ND; Manufacturer Part Number: CRCW0201360KFNED; RoHS: Yes; Stock: 14607; Pricing: 1=0,1, 10=0,037, 50=0,0242, 100=0,0204, 500=0,01426, 1000=0,01241, 5000=0,00924 (USD); Mounting Technology: Surface Mount; Pins: 2; Package Shape: Rectangular; Case/Package: 0201; Terminal Finish: Nickel; Min Operating Temperature: -55°C; Max Operating Temperature: 155°C; JESD-609 Code: e3; Resistor Type: FIXED RESISTOR; Construction: Chip; Package Style: SMTMeter; Packaging: Tape and Reel; Technology: METAL GLAZE/THICK FILM; Termination: Wraparound; Working Voltage: 30V; Reach SVHC Compliant: Yes; RoHS Compliant: Yes; ComponentLink1URL: https://datasheet.ciiva.com:443/pdfs/VipMasterIC/IC/VISH/VISH-S-A0002932828/VISH-S-A0002932828-1.pdf?src-supplier=IHS+Markit; ComponentLink1Description: https://datasheet.ciiva.com:443/pdfs/VipMasterIC/IC/VISH/VISH-S-A0002932828/VISH-S-A0002932828-1.pdf?src-supplier=IHS+Markit; ComponentLink2URL: https://datasheet.ciiva.com/2577/crcw0201e3-2577346.pdf?src-supplier=Digikey; ComponentLink2Description: https://datasheet.ciiva.com/2577/crcw0201e3-2577346.pdf?src-supplier=Digikey; ComponentLink3URL: https://datasheet.ciiva.com/8943/crcw0201e3-8943180.pdf?src-supplier=Avnet; ComponentLink3Description: https://datasheet.ciiva.com/8943/crcw0201e3-8943180.pdf?src-supplier=Avnet; ComponentLink4URL: https://datasheet.ciiva.com/22674/1700795-22674747.pdf?src-supplier=Element14; ComponentLink4Description: https://datasheet.ciiva.com/22674/1700795-22674747.pdf?src-supplier=Element14; ComponentLink5URL: https://datasheet.ciiva.com/22706/1719906-22706189.pdf?src-supplier=Element14; ComponentLink5Description: https://datasheet.ciiva.com/22706/1719906-22706189.pdf?src-supplier=Element14; ComponentLink6URL: https://datasheet.ciiva.com/7673/1719906-7673964.pdf?src-supplier=Element14; ComponentLink6Description: https://datasheet.ciiva.com/7673/1719906-7673964.pdf?src-supplier=Element14; ComponentLink7URL: https://datasheet.ciiva.com/7673/1719906-7673965.pdf?src-supplier=Element14; ComponentLink7Description: https://datasheet.ciiva.com/7673/1719906-7673965.pdf?src-supplier=Element14; Medical Grade MFR PN: TBD; Supplier 1: Digikey; Supplier Part Number 1: 541-CRCW0201360KFNEDCT-ND
R1023 = CRCW02012M20FNED: Fixed Resistor, Metal Glaze/thick Film, 0.05W, 2200000ohm, 30V, 1% +/-Tol, 200ppm/Cel, Surface Mount, 0201; Manufacturer: Vishay Draloric; Medical Grade MFR: TBD; Power: 50mW; Temperature Coefficient: 200ppm/°C; Rated Temperature: 70°C; Supplier: Digikey; Supplier Part Number: 541-CRCW02012M20FNEDCT-ND; Manufacturer Part Number: CRCW02012M20FNED; RoHS: Yes; Category: Chip SMD Resistors; Stock: 17414; Pricing: 1=0,1, 10=0,037, 50=0,0242, 100=0,0204, 500=0,01426, 1000=0,01241, 5000=0,00924 (USD); Mounting Technology: Surface Mount; Pins: 2; Case/Package: 0201; Terminal Finish: Nickel; Package Shape: Rectangular; Min Operating Temperature: -55°C; Max Operating Temperature: 155°C; JESD-609 Code: e3; Resistor Type: FIXED RESISTOR; Packaging: Tape and Reel; Technology: METAL GLAZE/THICK FILM; Working Voltage: 30V; Termination: Wraparound; Reach SVHC Compliant: Yes; RoHS Compliant: Yes; ComponentLink1URL: https://datasheet.ciiva.com:443/pdfs/VipMasterIC/IC/VISH/VISH-S-A0002932828/VISH-S-A0002932828-1.pdf?src-supplier=IHS+Markit; ComponentLink1Description: https://datasheet.ciiva.com:443/pdfs/VipMasterIC/IC/VISH/VISH-S-A0002932828/VISH-S-A0002932828-1.pdf?src-supplier=IHS+Markit; ComponentLink2URL: https://datasheet.ciiva.com/7800/1719906-7800943.pdf?src-supplier=Element14; ComponentLink2Description: https://datasheet.ciiva.com/7800/1719906-7800943.pdf?src-supplier=Element14; ComponentLink3URL: https://datasheet.ciiva.com/22682/1700795-22682622.pdf?src-supplier=Element14; ComponentLink3Description: https://datasheet.ciiva.com/22682/1700795-22682622.pdf?src-supplier=Element14; ComponentLink4URL: https://datasheet.ciiva.com/22702/1719906-22702669.pdf?src-supplier=Element14; ComponentLink4Description: https://datasheet.ciiva.com/22702/1719906-22702669.pdf?src-supplier=Element14; ComponentLink5URL: https://datasheet.ciiva.com/29926/crcw0201e3-29926006.pdf?src-supplier=Avnet; ComponentLink5Description: https://datasheet.ciiva.com/29926/crcw0201e3-29926006.pdf?src-supplier=Avnet; Medical Grade MFR PN: TBD; Supplier 1: Digikey; Supplier Part Number 1: 541-CRCW02012M20FNEDCT-ND
R1024 R1025 R1027 R1037 R1056 R1058 = CRCW02011M00FNED: Fixed Resistor, Metal Glaze/thick Film, 0.05W, 1000000ohm, 30V, 1% +/-Tol, 200ppm/Cel, Surface Mount, 0201; Manufacturer: Vishay; Medical Grade MFR: Mini-Systems; Medical Grade MFR PN: MWA96SM-1004F-NS62TR; Power: 50mW; Rated Temperature: 70°C; Temperature Coefficient: 200ppm/°C; Package Height: 0.23mm; Package Length: 0.6mm; Package Width: 0.3mm; Reference Standard: AEC-Q200; Category: Chip SMD Resistors; Supplier: Digikey; Supplier Part Number: 541-1.00MABCT-ND; Manufacturer Part Number: CRCW02011M00FNED; RoHS: Yes; Stock: 392914; Pricing: 1=0,1, 10=0,037, 50=0,0242, 100=0,0204, 500=0,01426, 1000=0,01241, 5000=0,00924 (USD); Mounting Technology: Surface Mount; Pins: 2; Package Shape: Rectangular; Case/Package: 0201; Terminal Finish: Nickel; Min Operating Temperature: -55°C; Max Operating Temperature: 155°C; JESD-609 Code: e3; Resistor Type: FIXED RESISTOR; Construction: Chip; Package Style: SMTMeter; Packaging: Tape and Reel; Technology: METAL GLAZE/THICK FILM; Termination: Wraparound; Working Voltage: 30V; Reach SVHC Compliant: Yes; RoHS Compliant: Yes; ComponentLink1URL: https://datasheet.ciiva.com:443/pdfs/VipMasterIC/IC/VISH/VISH-S-A0002932828/VISH-S-A0002932828-1.pdf?src-supplier=IHS+Markit; ComponentLink1Description: https://datasheet.ciiva.com:443/pdfs/VipMasterIC/IC/VISH/VISH-S-A0002932828/VISH-S-A0002932828-1.pdf?src-supplier=IHS+Markit; ComponentLink2URL: https://datasheet.ciiva.com/7841/1719906-7841438.pdf?src-supplier=Element14; ComponentLink2Description: https://datasheet.ciiva.com/7841/1719906-7841438.pdf?src-supplier=Element14; ComponentLink3URL: https://datasheet.ciiva.com/7841/1719906-7841439.pdf?src-supplier=Element14; ComponentLink3Description: https://datasheet.ciiva.com/7841/1719906-7841439.pdf?src-supplier=Element14; ComponentLink4URL: https://datasheet.ciiva.com/7859/dcrcwe3-7859689.pdf?src-supplier=Element14; ComponentLink4Description: https://datasheet.ciiva.com/7859/dcrcwe3-7859689.pdf?src-supplier=Element14; ComponentLink5URL: https://datasheet.ciiva.com/16757/70202042-16757675.pdf?src-supplier=Allied+Electronics; ComponentLink5Description: https://datasheet.ciiva.com/16757/70202042-16757675.pdf?src-supplier=Allied+Electronics; ComponentLink6URL: https://datasheet.ciiva.com/22692/1719906-22692761.pdf?src-supplier=Element14; ComponentLink6Description: https://datasheet.ciiva.com/22692/1719906-22692761.pdf?src-supplier=Element14; ComponentLink7URL: https://datasheet.ciiva.com/9109/crcw0201e3-9109910.pdf?src-supplier=Avnet; ComponentLink7Description: https://datasheet.ciiva.com/9109/crcw0201e3-9109910.pdf?src-supplier=Avnet; ComponentLink8URL: https://datasheet.ciiva.com/22675/1847332-22675065.pdf?src-supplier=Element14; ComponentLink8Description: https://datasheet.ciiva.com/22675/1847332-22675065.pdf?src-supplier=Element14; ComponentLink9URL: https://datasheet.ciiva.com/2474/crcw0201e3-2474824.pdf?src-supplier=Digikey; ComponentLink9Description: https://datasheet.ciiva.com/2474/crcw0201e3-2474824.pdf?src-supplier=Digikey; ComponentLink10URL: https://datasheet.ciiva.com/2474/crcw0201e3-2474825.pdf?src-supplier=Digikey; ComponentLink10Description: https://datasheet.ciiva.com/2474/crcw0201e3-2474825.pdf?src-supplier=Digikey; ComponentLink11URL: https://datasheet.ciiva.com/2474/crcw0201e3-2474826.pdf?src-supplier=Digikey; ComponentLink11Description: https://datasheet.ciiva.com/2474/crcw0201e3-2474826.pdf?src-supplier=Digikey; Supplier 1: Digikey; Supplier Part Number 1: 541-1.00MABCT-ND
R1028 R1059 = CRCW0201100KFNED: Fixed Resistor, Metal Glaze/thick Film, 0.05W, 100000ohm, 30V, 1% +/-Tol, 200ppm/Cel, Surface Mount, 0201; Manufacturer: Vishay; Medical Grade MFR: Mini-Systems; Medical Grade MFR PN: MWA96SM-1003F-NS62TR; Power: 50mW; Rated Temperature: 70°C; Temperature Coefficient: 200ppm/°C; Package Height: 0.23mm; Package Length: 0.6mm; Package Width: 0.3mm; Reference Standard: AEC-Q200; Category: Chip SMD Resistors; Supplier: Digikey; Supplier Part Number: 541-100KABCT-ND; Manufacturer Part Number: CRCW0201100KFNED; RoHS: Yes; Stock: 8252; Pricing: 1=0,1, 10=0,037, 50=0,0242, 100=0,0204, 500=0,01426, 1000=0,01241, 5000=0,00924 (USD); Mounting Technology: Surface Mount; Pins: 2; Package Shape: Rectangular; Case/Package: 0201; Terminal Finish: Nickel; Min Operating Temperature: -55°C; Max Operating Temperature: 155°C; JESD-609 Code: e3; Resistor Type: FIXED RESISTOR; Construction: Chip; Package Style: SMTMeter; Packaging: Tape and Reel; Technology: METAL GLAZE/THICK FILM; Termination: Wraparound; Working Voltage: 30V; Reach SVHC Compliant: Yes; RoHS Compliant: Yes; ComponentLink1URL: https://datasheet.ciiva.com:443/pdfs/VipMasterIC/IC/VISH/VISH-S-A0002932828/VISH-S-A0002932828-1.pdf?src-supplier=IHS+Markit; ComponentLink1Description: https://datasheet.ciiva.com:443/pdfs/VipMasterIC/IC/VISH/VISH-S-A0002932828/VISH-S-A0002932828-1.pdf?src-supplier=IHS+Markit; ComponentLink2URL: https://datasheet.ciiva.com/2474/crcw0201e3-2474797.pdf?src-supplier=Digikey; ComponentLink2Description: https://datasheet.ciiva.com/2474/crcw0201e3-2474797.pdf?src-supplier=Digikey; ComponentLink3URL: https://datasheet.ciiva.com/2474/crcw0201e3-2474798.pdf?src-supplier=Digikey; ComponentLink3Description: https://datasheet.ciiva.com/2474/crcw0201e3-2474798.pdf?src-supplier=Digikey; ComponentLink4URL: https://datasheet.ciiva.com/2474/crcw0201e3-2474799.pdf?src-supplier=Digikey; ComponentLink4Description: https://datasheet.ciiva.com/2474/crcw0201e3-2474799.pdf?src-supplier=Digikey; ComponentLink5URL: https://datasheet.ciiva.com/16436/dcrcwe3-16436220.pdf?src-supplier=Future+Electronics; ComponentLink5Description: https://datasheet.ciiva.com/16436/dcrcwe3-16436220.pdf?src-supplier=Future+Electronics; ComponentLink6URL: https://datasheet.ciiva.com/28634/1847332-28634462.pdf?src-supplier=Element14; ComponentLink6Description: https://datasheet.ciiva.com/28634/1847332-28634462.pdf?src-supplier=Element14; ComponentLink7URL: https://datasheet.ciiva.com/22665/1700795-22665689.pdf?src-supplier=Element14; ComponentLink7Description: https://datasheet.ciiva.com/22665/1700795-22665689.pdf?src-supplier=Element14; ComponentLink8URL: https://datasheet.ciiva.com/22870/70202042-22870476.pdf?src-supplier=Allied+Electronics; ComponentLink8Description: https://datasheet.ciiva.com/22870/70202042-22870476.pdf?src-supplier=Allied+Electronics; ComponentLink9URL: https://datasheet.ciiva.com/16777/70202042-16777655.pdf?src-supplier=Allied+Electronics; ComponentLink9Description: https://datasheet.ciiva.com/16777/70202042-16777655.pdf?src-supplier=Allied+Electronics; Supplier 1: Digikey; Supplier Part Number 1: 541-100KABCT-ND
R1029 R1060 = CRCW0201249KFNED: Fixed Resistor, Metal Glaze/thick Film, 0.05W, 249000ohm, 30V, 1% +/-Tol, 200ppm/Cel, Surface Mount, 0201; Manufacturer: Vishay; Medical Grade MFR: Mini-Systems; Medical Grade MFR PN: MWA96SM-2493F-NS62TR; Power: 50mW; Rated Temperature: 70°C; Temperature Coefficient: 200ppm/°C; Package Height: 0.23mm; Package Length: 0.6mm; Package Width: 0.3mm; Reference Standard: AEC-Q200; Category: Chip SMD Resistors; Supplier: Digikey; Supplier Part Number: 541-CRCW0201249KFNEDCT-ND; Manufacturer Part Number: CRCW0201249KFNED; RoHS: Yes; Stock: 82297; Pricing: 1=0,1, 10=0,037, 50=0,0242, 100=0,0204, 500=0,01426, 1000=0,01241, 5000=0,00924 (USD); Mounting Technology: Surface Mount; Pins: 2; Package Shape: Rectangular; Case/Package: 0201; Terminal Finish: Nickel; Min Operating Temperature: -55°C; Max Operating Temperature: 155°C; JESD-609 Code: e3; Resistor Type: FIXED RESISTOR; Construction: Chip; Package Style: SMTMeter; Packaging: Tape and Reel; Technology: METAL GLAZE/THICK FILM; Termination: Wraparound; Working Voltage: 30V; Reach SVHC Compliant: Yes; RoHS Compliant: Yes; ComponentLink1URL: https://datasheet.ciiva.com:443/pdfs/VipMasterIC/IC/VISH/VISH-S-A0002932828/VISH-S-A0002932828-1.pdf?src-supplier=IHS+Markit; ComponentLink1Description: https://datasheet.ciiva.com:443/pdfs/VipMasterIC/IC/VISH/VISH-S-A0002932828/VISH-S-A0002932828-1.pdf?src-supplier=IHS+Markit; ComponentLink2URL: https://datasheet.ciiva.com/8953/crcw0201e3-8953881.pdf?src-supplier=Avnet; ComponentLink2Description: https://datasheet.ciiva.com/8953/crcw0201e3-8953881.pdf?src-supplier=Avnet; Supplier 1: Digikey; Supplier Part Number 1: 541-CRCW0201249KFNEDCT-ND
R1030 R1061 = CRCW0201910KFNED: Fixed Resistor, Metal Glaze/thick Film, 0.05W, 910000ohm, 30V, 1% +/-Tol, 200ppm/Cel, Surface Mount, 0201; Manufacturer: Vishay Draloric; Medical Grade MFR: TBD; Power: 50mW; Rated Temperature: 70°C; Temperature Coefficient: 200ppm/°C; Category: Chip SMD Resistors; Supplier: Digikey; Supplier Part Number: 541-CRCW02016M80FNEDCT-ND; Manufacturer Part Number: CRCW0201910KFNED; RoHS: Yes; Stock: 8955; Pricing: 1=0,1, 10=0,037, 50=0,0242, 100=0,0204, 500=0,01426, 1000=0,01241, 5000=0,00924 (USD); Mounting Technology: Surface Mount; Pins: 2; Package Shape: Rectangular; Case/Package: 0201; Terminal Finish: Nickel; Min Operating Temperature: -55°C; Max Operating Temperature: 155°C; JESD-609 Code: e3; Resistor Type: FIXED RESISTOR; Packaging: Tape and Reel; Technology: METAL GLAZE/THICK FILM; Termination: Wraparound; Working Voltage: 30V; Reach SVHC Compliant: Yes; RoHS Compliant: Yes; ComponentLink1URL: https://datasheet.ciiva.com:443/pdfs/VipMasterIC/IC/VISH/VISH-S-A0002932828/VISH-S-A0002932828-1.pdf?src-supplier=IHS+Markit; ComponentLink1Description: https://datasheet.ciiva.com:443/pdfs/VipMasterIC/IC/VISH/VISH-S-A0002932828/VISH-S-A0002932828-1.pdf?src-supplier=IHS+Markit; ComponentLink2URL: https://datasheet.ciiva.com/22682/1700795-22682637.pdf?src-supplier=Element14; ComponentLink2Description: https://datasheet.ciiva.com/22682/1700795-22682637.pdf?src-supplier=Element14; Medical Grade MFR PN: TBD; Supplier 1: Digikey; Supplier Part Number 1: 541-CRCW0201910KFNEDDKR-ND
R1035 R1040 = CRCW02016M80FNED: Fixed Resistor, Metal Glaze/thick Film, 0.05W, 6800000ohm, 30V, 1% +/-Tol, 200ppm/Cel, Surface Mount, 0201; Manufacturer: Vishay Draloric; Medical Grade MFR: TBD; Power: 50mW; Rated Temperature: 70°C; Temperature Coefficient: 200ppm/°C; Supplier: Digikey; Supplier Part Number: 541-CRCW02016M80FNEDCT-ND; Manufacturer Part Number: CRCW02016M80FNED; RoHS: Yes; Category: Chip SMD Resistors; Stock: 8955; Pricing: 1=0,1, 10=0,037, 50=0,0242, 100=0,0204, 500=0,01426, 1000=0,01241, 5000=0,00924 (USD); Mounting Technology: Surface Mount; Pins: 2; Package Shape: Rectangular; Case/Package: 0201; Terminal Finish: Nickel; Min Operating Temperature: -55°C; Max Operating Temperature: 155°C; JESD-609 Code: e3; Resistor Type: FIXED RESISTOR; Packaging: Tape and Reel; Technology: METAL GLAZE/THICK FILM; Termination: Wraparound; Working Voltage: 30V; Reach SVHC Compliant: Yes; RoHS Compliant: Yes; ComponentLink1URL: https://datasheet.ciiva.com:443/pdfs/VipMasterIC/IC/VISH/VISH-S-A0002932828/VISH-S-A0002932828-1.pdf?src-supplier=IHS+Markit; ComponentLink1Description: https://datasheet.ciiva.com:443/pdfs/VipMasterIC/IC/VISH/VISH-S-A0002932828/VISH-S-A0002932828-1.pdf?src-supplier=IHS+Markit; ComponentLink2URL: https://datasheet.ciiva.com/22682/1700795-22682637.pdf?src-supplier=Element14; ComponentLink2Description: https://datasheet.ciiva.com/22682/1700795-22682637.pdf?src-supplier=Element14; Medical Grade MFR PN: TBD; Supplier 1: Digikey; Supplier Part Number 1: 541-CRCW02016M80FNEDCT-ND
R1054 R1055 = RC0201FR-071M8L: Resistor, 1.8M, 1%, 0201; Manufacturer: Yageo; Medical Grade MFR: TBD; Rating: 25V; Length (mm): 0.6; Manufacturer Part Number: RC0201FR-071M8L; Medical Grade MFR PN: TBD; PCB Footprint: R0201_C; Thickness (mm): 0.23; Width (mm): 0.3; Category: Resistor; Status: *; Review: *; Supplier 1: Digikey; Supplier Part Number 1: 13-RC0201FR-071M8LCT-ND; Supplier 2: Digikey; Supplier Part Number 2: 13-RC0201FR-071M8LDKR-ND; Supplier 3: Digikey; Supplier Part Number 3: 13-RC0201FR-071M8LTR-ND; Supplier 4: Mouser; Supplier Part Number 4: 603-RC0201FR-071M8L
TP1000 TP1001 TP1003-TP1021 = Test Point: Test pad, 0.90mm circular pad; PCB Footprint: testpad_0p90mm; Length (mm): 0.90; Manufacturer: N/A; Manufacturer PN: N/A; Medical Grade MFR: N/A; Medical Grade MFR PN: N/A; Rating: N/A; Thickness (mm): N/A; Value: Test point; Width (mm): 0.90; Category: Test point; Status: *; Review: *
U1000 U1002 = AD8232ACPZ-R7: Analog Circuit, 1 Func, 1 Channel; Channels: 1; Max Supply Voltage: 3.5V; Min Supply Voltage: 2V; Nominal Supply Voltage: 3V; Voltage supply: 2-3.5V; Current supply: 170uA; CMRR: 80dB; Gain: 100V/V; Bandwidth: 2kHz; Supplier: Mouser; Manufacturer Part Number: AD8232ACPZ-R7; RoHS: Yes; Category: Amplifiers - Op Amps, Buffer, Instrumentation; Stock: 3930; Pricing: 1=4,71, 10=4,07, 50=4,07, 100=3,57, 1000=2,53, 10000=2,37 (USD); Case/Package: HVQCCN; Pins: 20; Package Shape: Square; Min Operating Temperature: -40°C; Max Operating Temperature: 85°C; Package Style: CHIP CARRIER, HEAT SINK/SLUG, VERY THIN PROFILEMeter; Surface Mount: Yes; Terminal Form: No Lead; Terminal Position: QUAD; Throw Configuration: ANALOG CIRCUIT; JESD-30 Code: S-XQCC-N20; Length: 4mm; Width: 4mm; Height - Seated (Max): 0.8mm; Terminal Pitch: 0.5mm; Temperature Grade: INDUSTRIAL; RoHS Compliant: Yes; Reach SVHC Compliant: Yes; ComponentLink1URL: https://datasheet.ciiva.com:443/pdfs/VipMasterIC/IC/ANDI/ANDI-S-A0005264682/ANDI-S-A0005264682-1.pdf?src-supplier=IHS+Markit; ComponentLink1Description: https://datasheet.ciiva.com:443/pdfs/VipMasterIC/IC/ANDI/ANDI-S-A0005264682/ANDI-S-A0005264682-1.pdf?src-supplier=IHS+Markit; ComponentLink2URL: https://datasheet.ciiva.com/6579/ad8232-6579751.pdf?src-supplier=Digi-Key; ComponentLink2Description: https://datasheet.ciiva.com/6579/ad8232-6579751.pdf?src-supplier=Digi-Key; ComponentLink3URL: https://datasheet.ciiva.com/6579/ad8232-6579754.pdf?src-supplier=Digi-Key; ComponentLink3Description: https://datasheet.ciiva.com/6579/ad8232-6579754.pdf?src-supplier=Digi-Key; ComponentLink4URL: https://datasheet.ciiva.com/6579/ad8232-6579770.pdf?src-supplier=Digi-Key; ComponentLink4Description: https://datasheet.ciiva.com/6579/ad8232-6579770.pdf?src-supplier=Digi-Key; Supplier 1: Mouser; Supplier Part Number 1: 584-AD8232ACPZ-R7
U1001 U1003 = AD8233ACBZ-R7: Analog front end, ECG, RLD amp, BGA-20; Medical Grade MFR: TBD; Voltage supply: 1.7-3.5V; Current supply: 50uA; CMRR: 86dB; Gain: 40dB; Bandwidth: 1kHz; Category: IC; Length (mm): 2.04 ±0.04; Medical Grade MFR PN: TBD; Package Description: TBD; PCB Footprint: TBD; Rating: TBD; Thickness (mm): 0.50 ±0.06; Value: AD8233ACBZ-R7; Width (mm): 1.71 ±0.04; Supplier 1: Digi-Key; Supplier Part Number 1: 505-AD8233ACBZ-R7CT-ND; Status: *; Review: *; Manufacturer Part Number: AD8233ACBZ-R7